# Altium schematic sheet 滑板车模块-201119.SchDoc
size A3
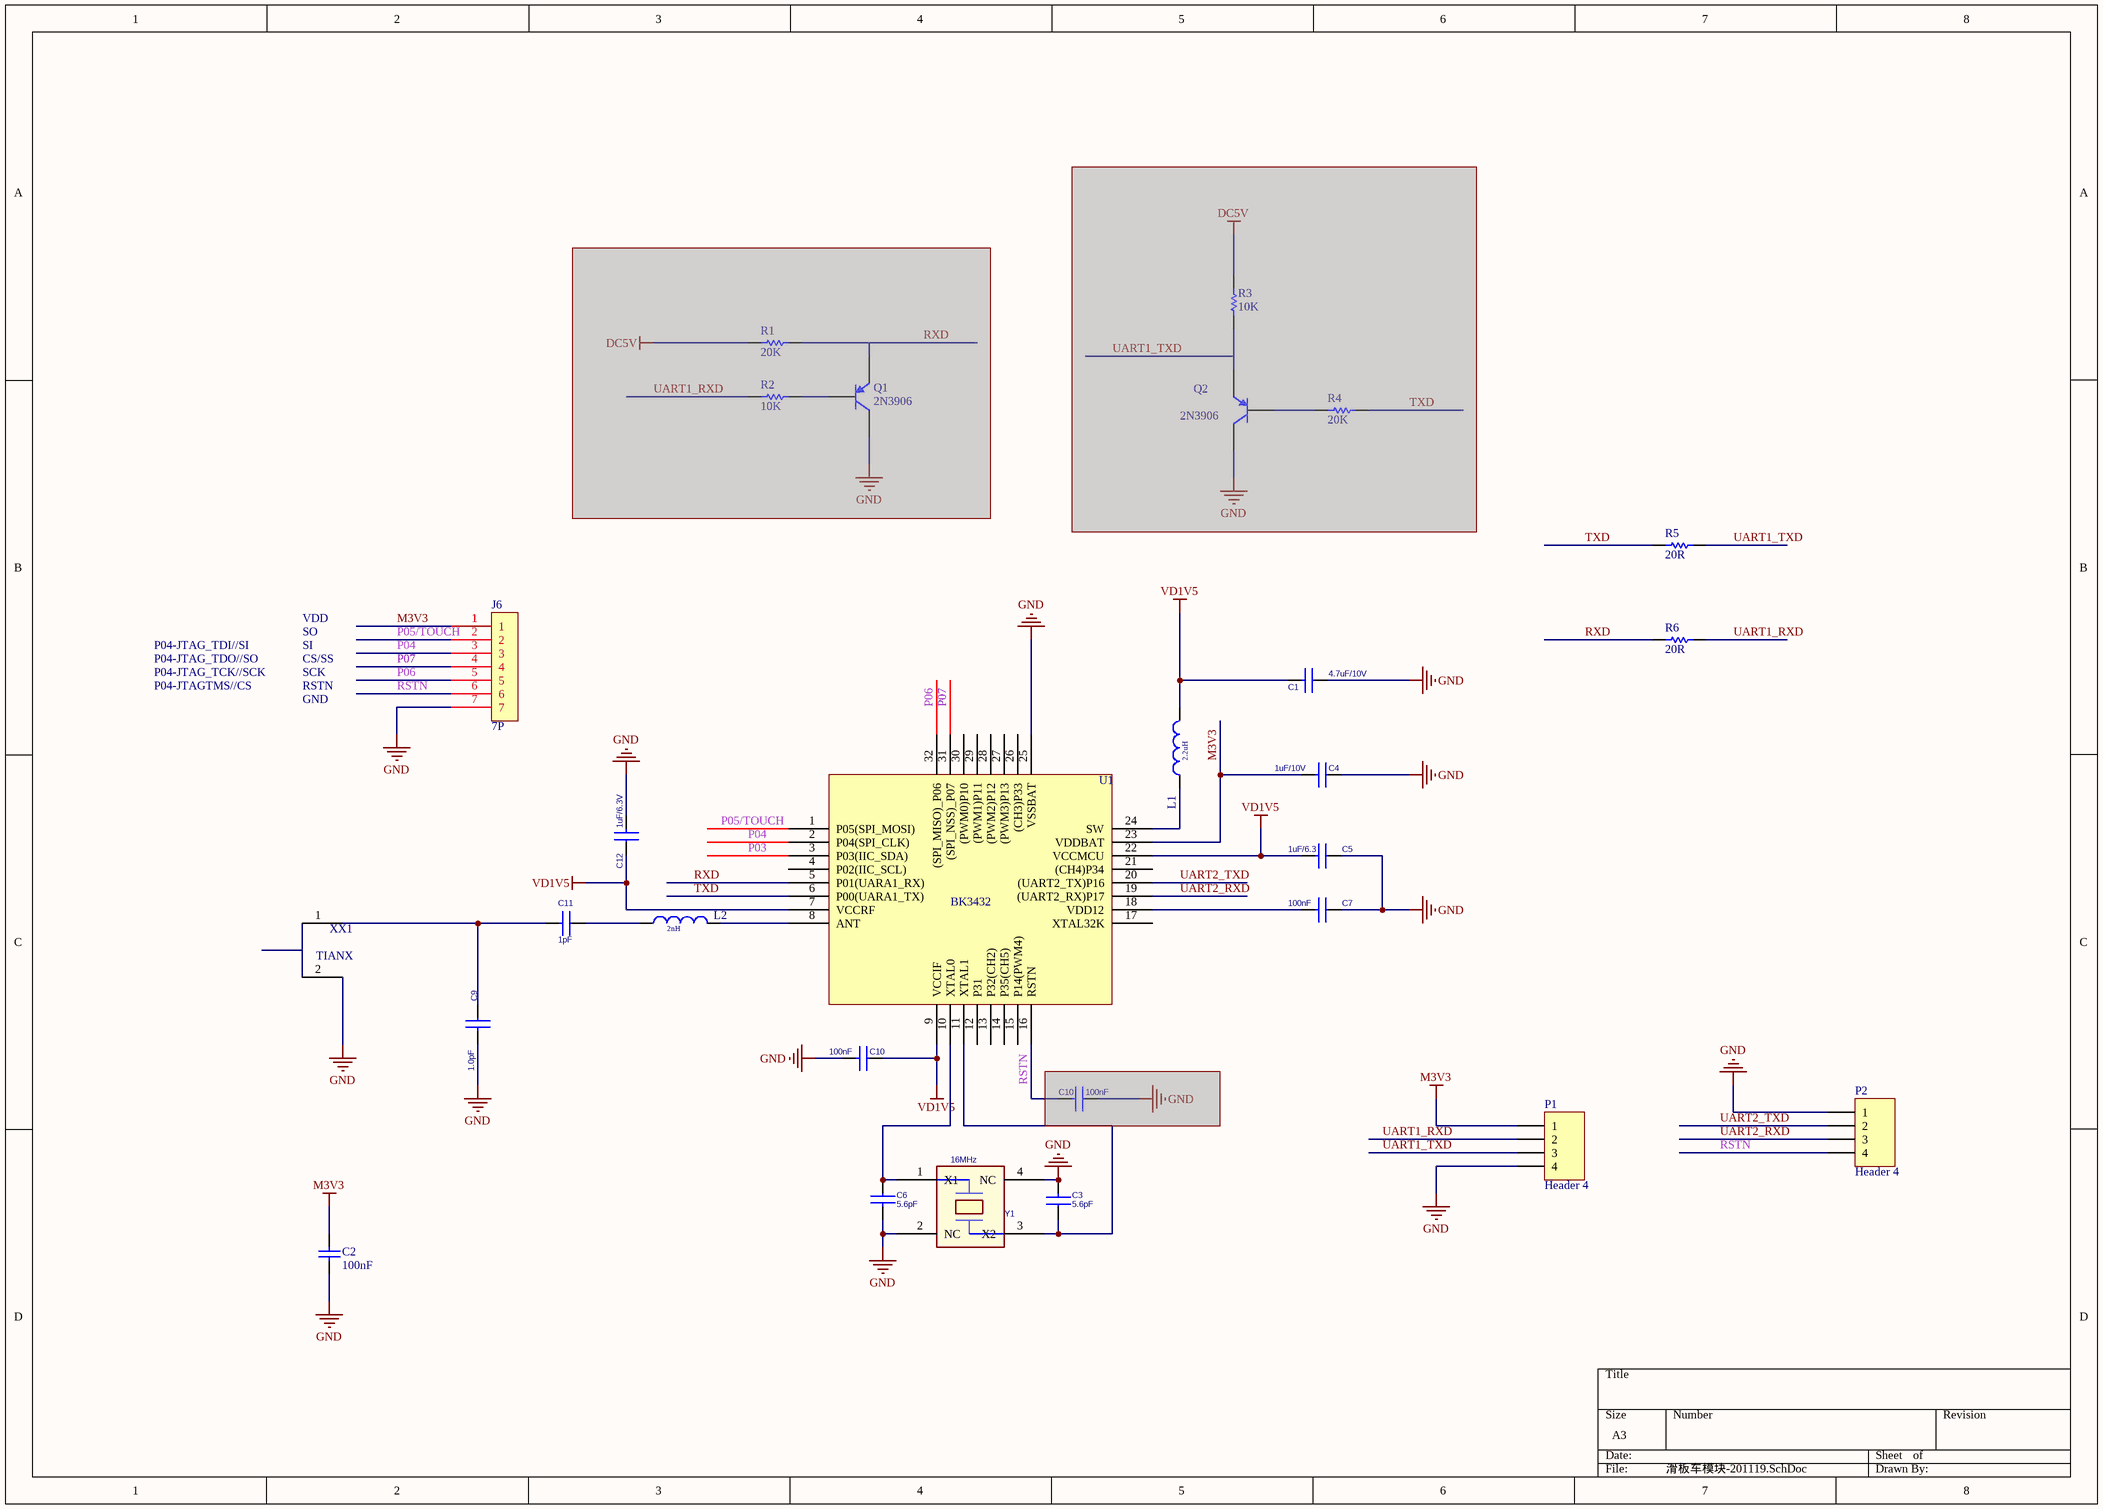
[diagram p0: 滑板车模块-201119.SchDoc]

## Parts
(Parts that share a designator on the sheet are numbered #1, #2 ... from top to bottom, then left to right.)
C1  4.7uF/10V  [LC-0402_C]
C2  100nF  [LC-0402_C]
C3  5.6pF  [LC-0402_C]
C4  1uF/10V  [LC-0402_C]
C5  1uF/6.3  [LC-0402_C]
C6  5.6pF  [LC-0402_C]
C7  100nF  [LC-0402_C]
C9  1.0pF  [LC-0402_C]
C10#1  100nF  [LC-0402_C]
C10#2  100nF  [LC-0402_C]  (masked out: inside a compile mask, not in the netlist)
C11  1pF  [LC-0402_C]
C12  1uF/6.3V  [LC-0402_C]
J6  7P  [7P-1.5MM]
L1  2.2uH  [L0402]
L2  2nH  [LC-0402_L]
P1  Header 4  [4P-2.0MM]
P2  Header 4  [4P-2.0MM]
Q1  2N3906  [SOT-23-3]  (masked out: inside a compile mask, not in the netlist)
Q2  2N3906  [SOT-23-3]  (masked out: inside a compile mask, not in the netlist)
R1  20K  [0603R]  (masked out: inside a compile mask, not in the netlist)
R2  10K  [0603R]  (masked out: inside a compile mask, not in the netlist)
R3  10K  [0603R]  (masked out: inside a compile mask, not in the netlist)
R4  20K  [0603R]  (masked out: inside a compile mask, not in the netlist)
R5  20R  [0402R]
R6  20R  [0402R]
U1  BK3432  [LC-VQFN-32_4x4x04P]
XX1  TIANX  [BT_NAMI_NO]
Y1  16MHz  [SMT-3225]

## Nets
GND: C1.1 C2.2 C3.2 C4.1 C5.1 C6.2 C7.1 C9.2 C10#1.2 C12.2 J6.7 P1.4 P2.1 U1.25(VSSBAT) XX1.2 Y1.2(NC) Y1.4(NC)
M3V3: C2.1 C4.2 J6.1 P1.1 U1.23(VDDBAT)
VD1V5: C1.2 C5.2 C10#1.1 C12.1 L1.2(P2) U1.7(VCCRF) U1.9(VCCIF) U1.22(VCCMCU)
P03: U1.3(P03(IIC_SDA))
P04: J6.3 U1.2(P04(SPI_CLK))
P05/TOUCH: J6.2 U1.1(P05(SPI_MOSI))
P06: J6.5 U1.32((SPI_MISO)_P06)
P07: J6.4 U1.31((SPI_NSS)_P07)
RSTN: J6.6 P2.4 U1.16(RSTN)
RXD: R6.1 U1.5(P01(UARA1_RX))
TXD: R5.1 U1.6(P00(UARA1_TX))
UART1_RXD: P1.2 R6.2
UART1_TXD: P1.3 R5.2
UART2_RXD: P2.3 U1.19((UART2_RX)P17)
UART2_TXD: P2.2 U1.20((UART2_TX)P16)
NetC3_1: C3.1 U1.11(XTAL1) Y1.3(X2)
NetC6_1: C6.1 U1.10(XTAL0) Y1.1(X1)
NetC7_2: C7.2 U1.18(VDD12)
NetC9_1: C9.1 C11.2 XX1.1
NetC11_1: C11.1 L2.1(P1)
NetL1_1: L1.1(P1) U1.24(SW)
NetL2_2: L2.2(P2) U1.8(ANT)

Not connected (* = marked no-connect by the designer): U1 4(P02(IIC_SCL)) 12(P31) 13(P32(CH2)) 14(P35(CH5)) 15(P14(PWM4)) 17(XTAL32K) 21((CH4)P34) 26((CH3)P33) 27((PWM3)P13) 28((PWM2)P12) 29((PWM1)P11) 30((PWM0)P10)

## Notes on the sheet
- P04-JTAG_TDI//SI
- SI
- SO
- VDD
- P04-JTAG_TDO//SO
- P04-JTAG_TCK//SCK
- P04-JTAGTMS//CS
- RSTN
- SCK
- CS/SS
- GND

## Library data of the parts
C1 C3-C7 C9 C10#1 C10#2 C11 C12 = CAP0603
C2 = CAP-NP: Capacitor, Ceramic; Capacitance: 18 pF; Dielectric: COG; Polarity: Non-Polarized; Rated Voltage: 50 mV; Tolerance: 5 %; Category: Capacitor; Mounting Technology: Surface Mount; Status: Unreleased; Technology: Ceramic
L1 L2 = INDUCTOR: Power Inductor, 4.7uH, 0.7A, 260mR DCR; XMOS Part Number: E-09-0011; Manufacturer: Taiyo Yuden; Manufacturer Part Number: CBC2518T4R7M; Part Creator: JG; LEVEL: STD; DEVICE: L; FORWARD_PCB: 1; Tolerance (%): 20; Max DC Resistance: 0.26R; Rated Current (Saturation): 0.68A; Rated Current (Temp Rise): 0.92A; Approx Volume Cost ($): 0.07; Approved: NO; VALUE: 2.0nH; Datasheet: http://www.yuden.co.jp/us/product/pdf/ecb2_e.pdf; Max Height (mm): 2; Digikey Link: http://search.digikey.com/scripts/DkSearch/dksus.dll?lang=en&site=US&keywords=CBC2518T4R7M
P1 P2 = Header 4: Header, 4-Pin; LatestRevisionDate: 17-Jul-2002; LatestRevisionNote: Re-released for DXP Platform.; Publisher: Altium Limited
Q1 Q2 = 2N3906: PNP General Purpose Amplifier; Published: 8-Jun-2000; LatestRevisionDate: 15-Jan-2003; LatestRevisionNote: PCB Footprint 'BCY-W3/D4.7' replaced; DatasheetVersion: 1997; PackageVersion: Sep-1998; PackageReference: TO-92A; Publisher: Altium Limited; PackageDescription: TO, Flat Index; 3 In-Line, Axial Leads; Body Dia. 4.5mm; Leads 0.51 x 0.48 mm (max); ComponentLink1Description: Manufacturer Link; ComponentLink1URL: http://www.fairchildsemi.com/; ComponentLink2Description: Datasheet; ComponentLink2URL: http://www.fairchildsemi.com/ds/2N%2F2N3906.pdf
R1-R6 = Res1: Resistor; Value: 1K; Published: 8-Jun-2000; LatestRevisionDate: 17-Jul-2002; LatestRevisionNote: Re-released for DXP Platform.; PackageReference: AXIAL-0.3; Publisher: Altium Limited; PackageDescription: Axial Device, Thru-Hole; 2 Leads; 0.3 in Pin Spacing
Y1 = OSCILATOR_0